# Altium schematic sheet PCF8563.SchDoc
size A4
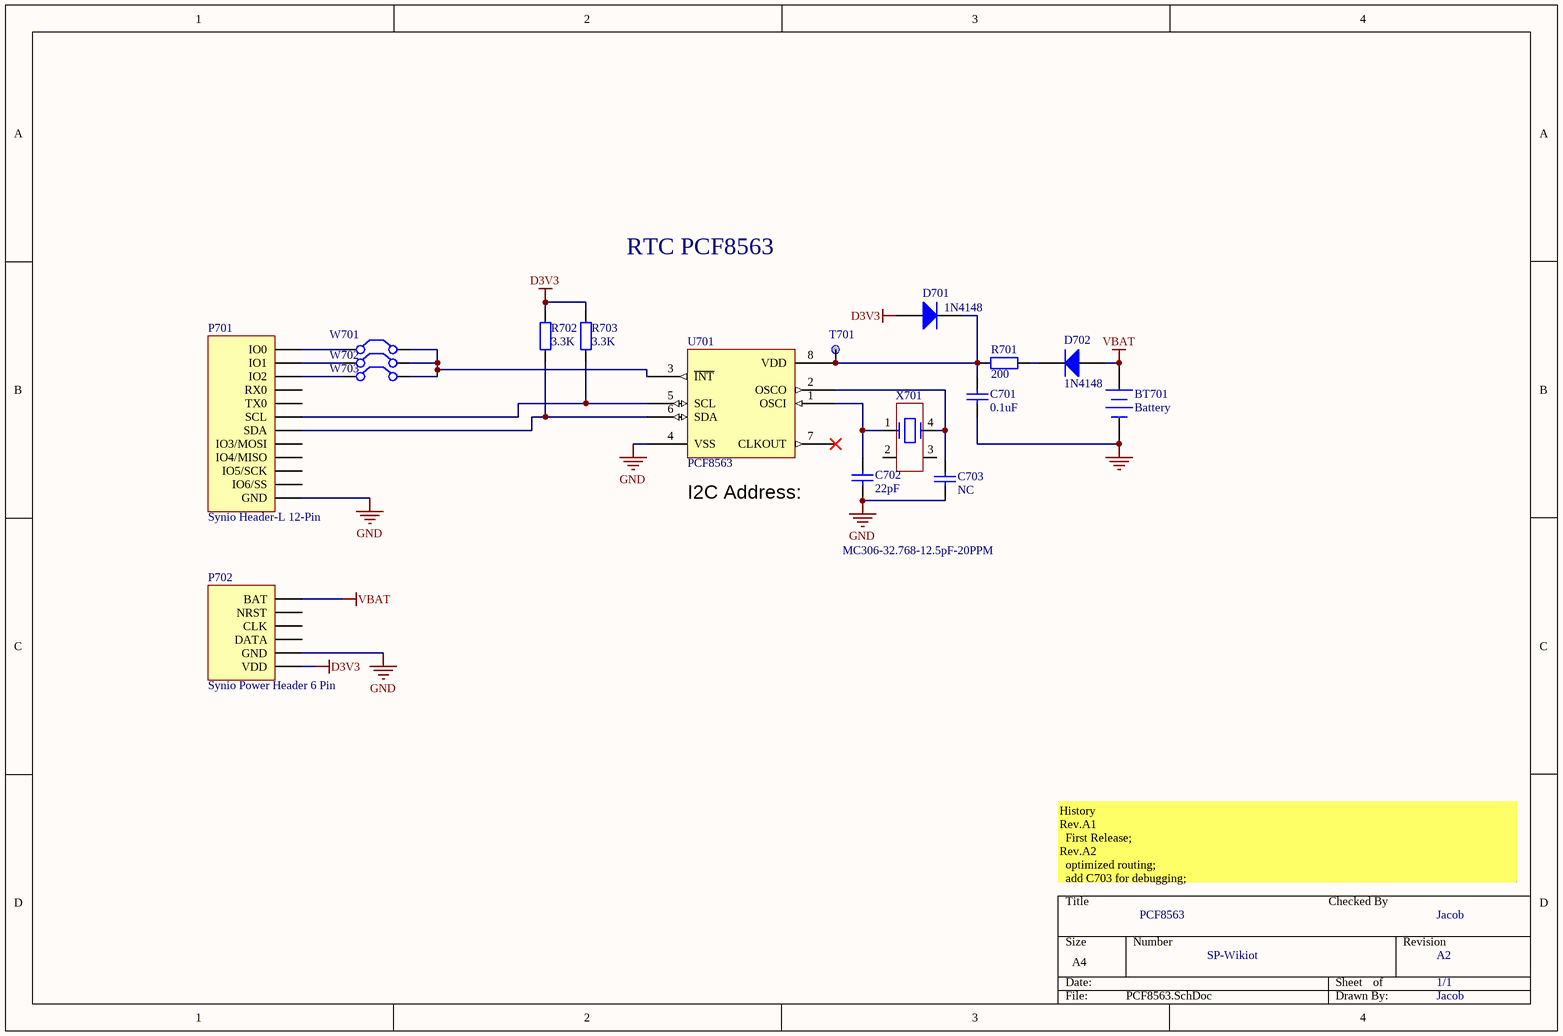
[diagram p0: PCF8563.SchDoc]

## Parts
BT701  Battery  [BAT CR1220]
C701  0.1uF  [0603M]
C702  22pF  [0603M]
C703  NC  [0603M]
D701  1N4148  [1206]
D702  1N4148  [1206]
P701  Synio Header-L 12-Pin  [HDR1X12]
P702  Synio Power Header 6 Pin  [HDR1X6/2.54MM]
R701  200  [R0603]
R702  3.3K  [R0603]
R703  3.3K  [R0603]
T701  TP  [TP]  (value not drawn)
U701  PCF8563  [SO8W_M]
W701  Jumper2-1  [HDR1X2/2.00MM]  (value not drawn)
W702  Jumper2-1  [HDR1X2/2.00MM]  (value not drawn)
W703  Jumper2-1  [HDR1X2/2.00MM]  (value not drawn)
X701  MC306-32.768-12.5pF-20PPM  [SM8]

## Nets
D3V3: D701.1(A) P702.1(VDD) R702.2 R703.2
GND: BT701.2(-) C701.1 C702.1 C703.1 P701.1(GND) P702.2(GND) U701.4(VSS)
VBAT: BT701.1(+) D702.1(A) P702.6(BAT)
NetC701_2: C701.2 D701.2(K) R701.1 T701.1 U701.8(VDD)
NetC702_2: C702.2 U701.1(OSCI) X701.1
NetC703_2: C703.2 U701.2(OSCO) X701.4
NetD702_2: D702.2(K) R701.2
NetP701_6: P701.6(SDA) R702.1 U701.6(SDA)
NetP701_7: P701.7(SCL) R703.1 U701.5(SCL)
NetP701_10: P701.10(IO2) W703.1(C1)
NetP701_11: P701.11(IO1) W702.1(C1)
NetP701_12: P701.12(IO0) W701.1(C1)
NetU701_3: U701.3(~{INT}) W701.2(C2) W702.2(C2) W703.2(C2)

Not connected (* = marked no-connect by the designer): P701 2(IO6/SS) 3(IO5/SCK) 4(IO4/MISO) 5(IO3/MOSI) 8(TX0) 9(RX0); P702 3(DATA) 4(CLK) 5(NRST); U701 7(CLKOUT)*; X701 2 3

## Notes on the sheet
- RTC PCF8563
- I2C Address:
- History
  Rev.A1
  First Release;
  Rev.A2
  optimized routing;
  add C703 for debugging;
- PCF8563
- Checked By
- Jacob
- SP-Wikiot
- A2
- 1/1

## Library data of the parts
BT701 = Battery: Multicell Battery; Published: 24-Mar-1999; LatestRevisionDate: 17-Jul-2002; LatestRevisionNote: Re-released for DXP Platform.; PackageReference: BAT-2; Publisher: Altium Limited; PackageDescription: Battery; 2 Leads
C701-C703 = Cap: Capacitor; Published: 8-Jun-2000; LatestRevisionDate: 17-Jul-2002; LatestRevisionNote: Re-released for DXP Platform.; PackageReference: RAD-0.3
  C701: Value: 0.1uF
  C702: Value: 22pF
  C703: Value: NC
D701 D702 = Diode 1N4007: 1 Amp General Purpose Rectifier; Published: 8-Jun-2000; LatestRevisionDate: 17-Jul-2002; LatestRevisionNote: Re-released for DXP Platform.; DatasheetVersion: 1998; PackageVersion: Aug-1999; PackageReference: DO-41; Publisher: Altium Limited; PackageDescription: Diode, Axial; Body 5.2 x 2.7 mm (LxDia. max), Lead Dia. 0.86 mm (max); Code_JEDEC: DO-204-AL; ComponentLink1Description: Manufacturer Link; ComponentLink1URL: http://www.fairchildsemi.com/; ComponentLink2Description: Datasheet; ComponentLink2URL: http://www.fairchildsemi.com/ds/1N%2F1N4001.pdf
P701 = Synio Header-L 12-Pin: Synio Header-L, 12-Pin; LatestRevisionDate: 17-Jul-2002; LatestRevisionNote: Re-released for DXP Platform.; Publisher: Altium Limited
R701-R703 = Res2: Resistor; Published: 8-Jun-2000; LatestRevisionDate: 17-Jul-2002; LatestRevisionNote: Re-released for DXP Platform.; PackageReference: AXIAL-0.4; Publisher: Altium Limited
  R701: Value: 200
  R702 R703: Value: 3.3K
T701 = TP: Test Point
U701 = PCF8563: Real Time Clock/Calendar
W701-W703 = Jumper2-1: Jumper Wire; Published: 24-Mar-1999; LatestRevisionDate: 17-Jul-2002; LatestRevisionNote: Re-released for DXP Platform.; PackageReference: RAD-0.2; Publisher: Altium Limited
X701 = MC306